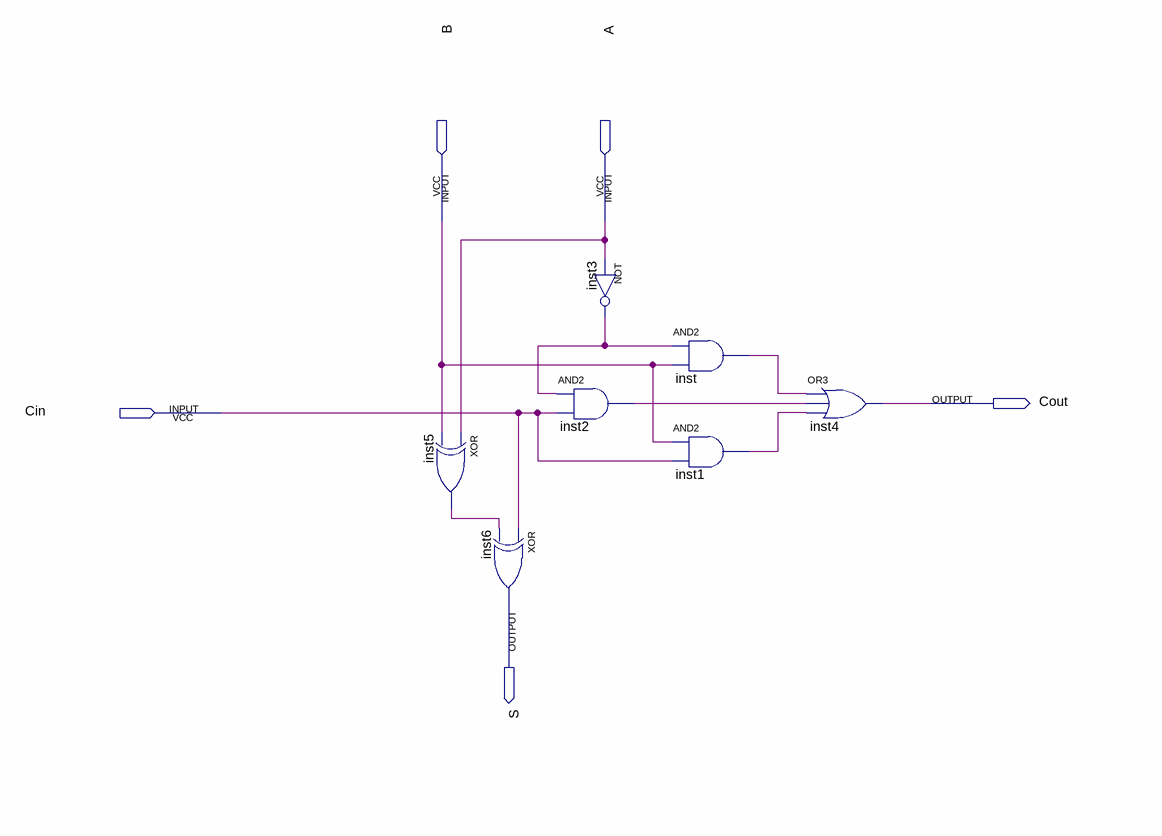
[diagram p0: schematic sheet]
// Quartus schematic FD.bdf as structural Verilog: 7 symbols, 5 pins
module FD (
  input  B,
  input  A,
  input  Cin,
  output Cout,
  output S
);

  wire inst1_out, inst2_out, inst3_out, inst5_out, inst_out;

  xor inst5 (inst5_out, A, B);
  xor inst6 (S, Cin, inst5_out);
  not inst3 (inst3_out, A);
  and inst2 (inst2_out, inst3_out, Cin);
  and inst (inst_out, inst3_out, B);
  and inst1 (inst1_out, B, Cin);
  or inst4 (Cout, inst_out, inst2_out, inst1_out);
endmodule
